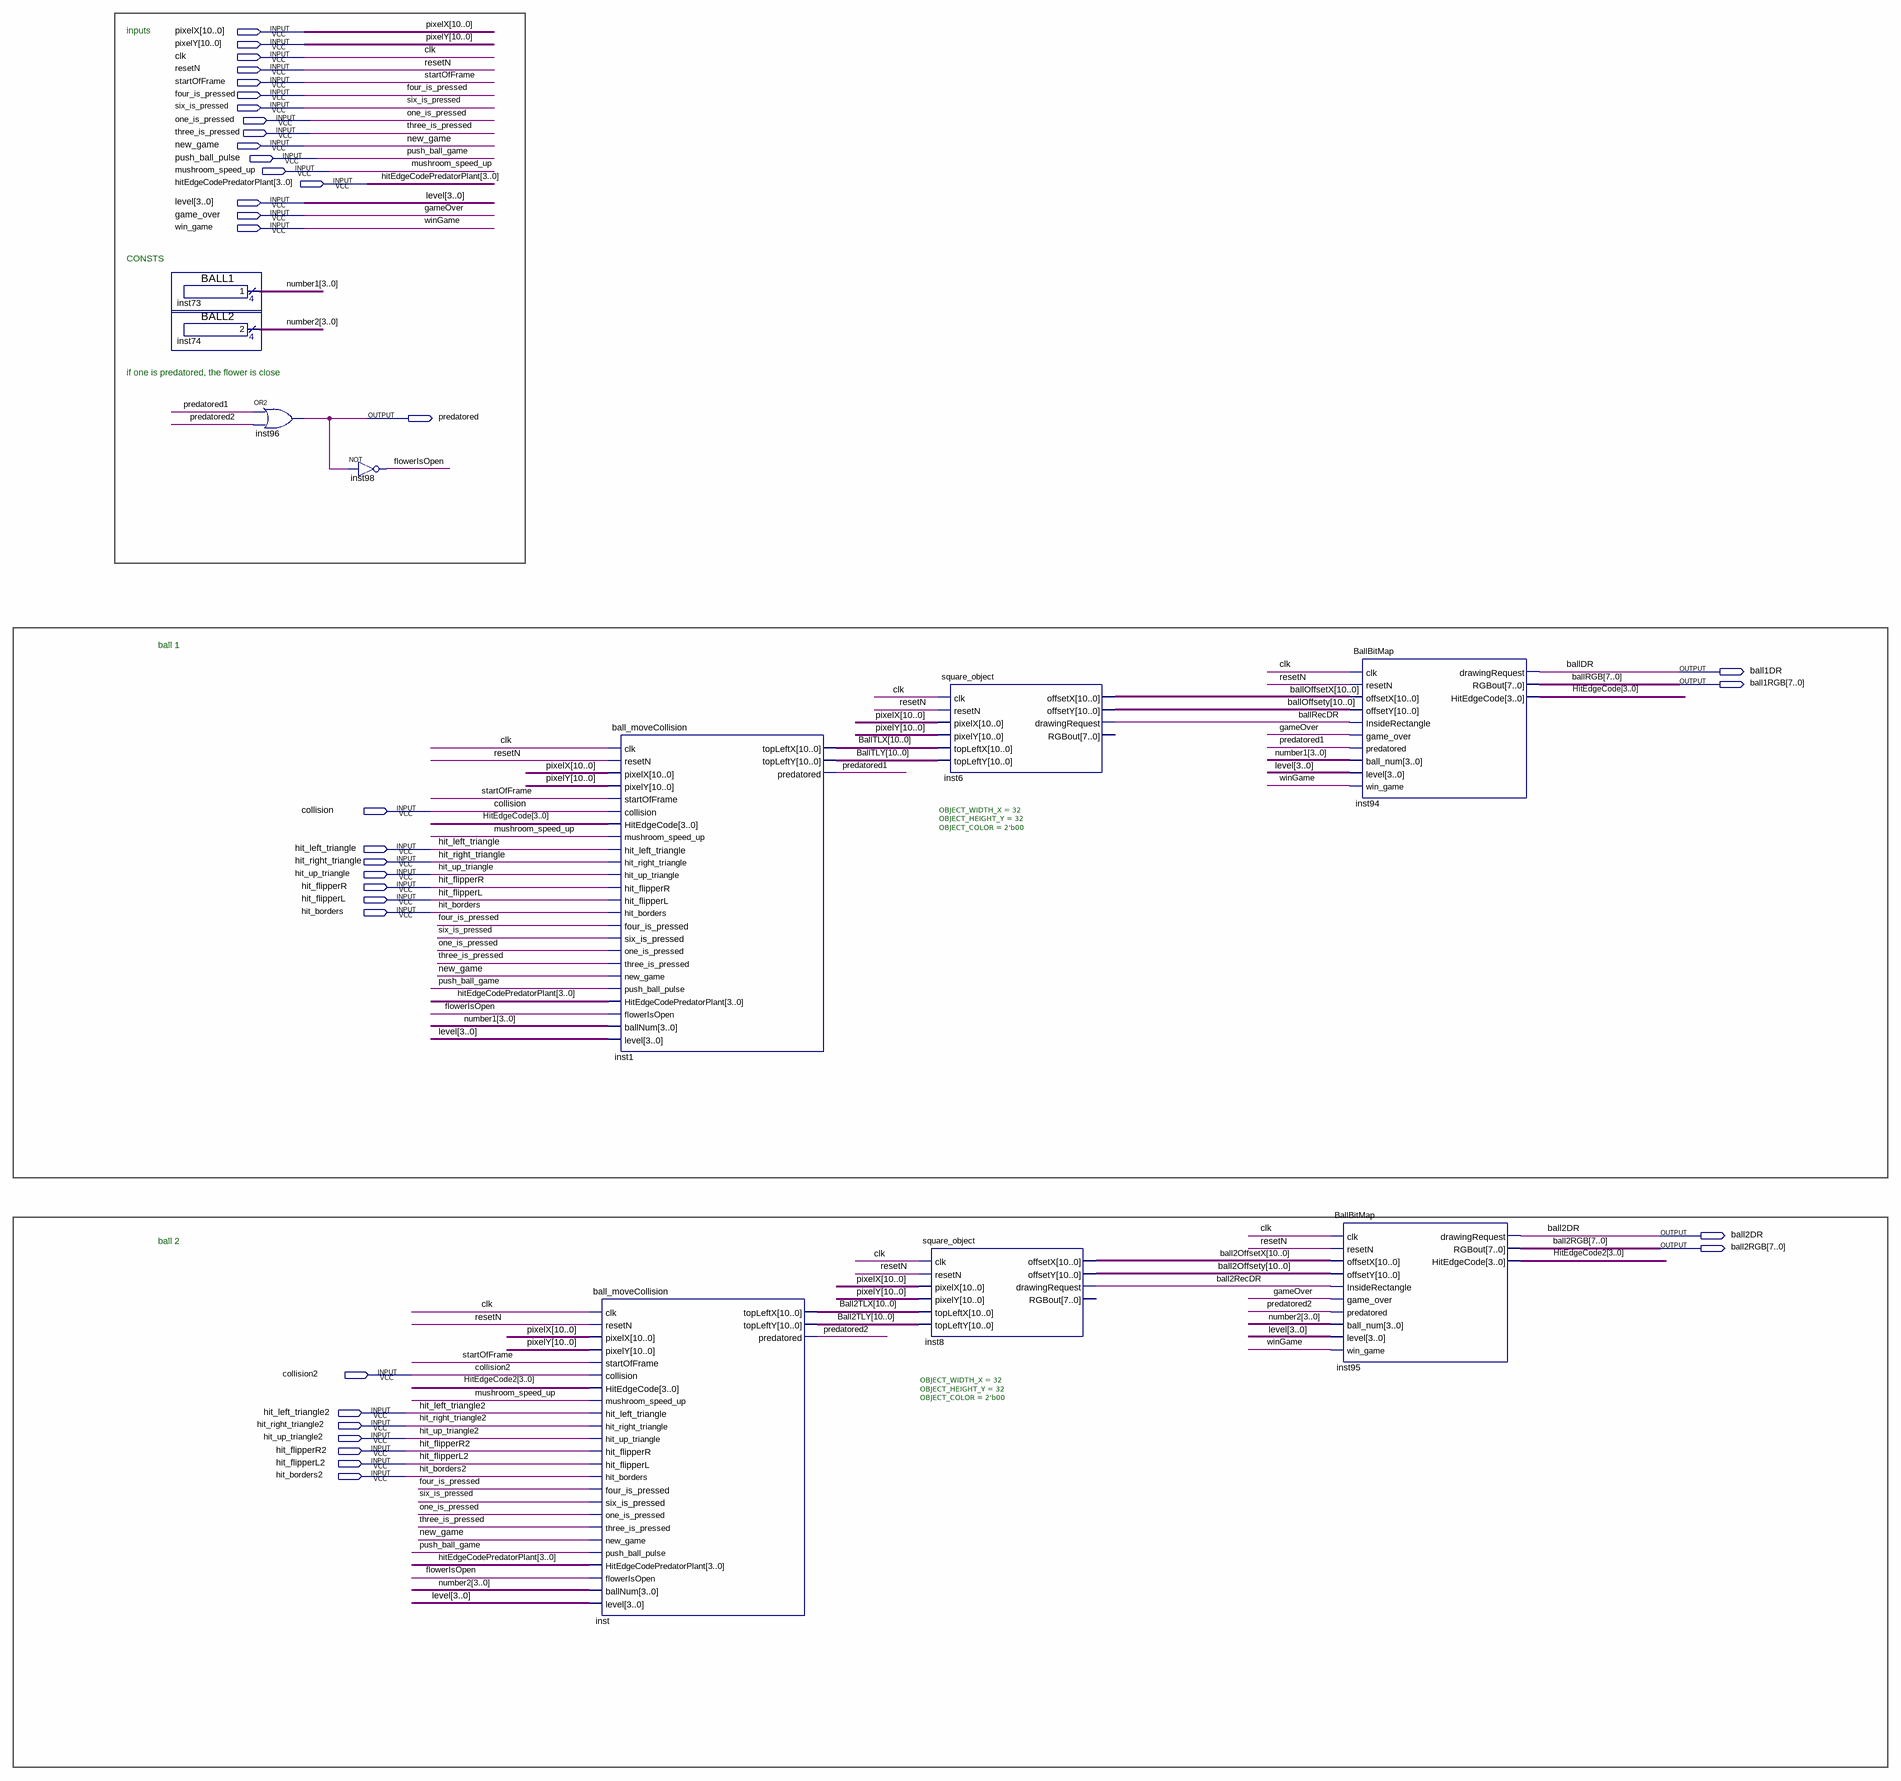
[diagram p0: schematic sheet]
// Quartus schematic BALL_BLOCK.bdf as structural Verilog: 10 symbols, 35 pins
module BALL_BLOCK (
  input  [10:0] pixelX,
  input  [10:0] pixelY,
  input  clk,
  input  resetN,
  input  startOfFrame,
  input  four_is_pressed,
  input  six_is_pressed,
  input  one_is_pressed,
  input  three_is_pressed,
  input  new_game,
  input  push_ball_pulse,
  input  mushroom_speed_up,
  input  [3:0] hitEdgeCodePredatorPlant,
  input  [3:0] level,
  input  game_over,
  input  win_game,
  input  collision,
  input  hit_left_triangle,
  input  hit_right_triangle,
  input  hit_up_triangle,
  input  hit_flipperR,
  input  hit_flipperL,
  input  hit_borders,
  input  collision2,
  input  hit_left_triangle2,
  input  hit_right_triangle2,
  input  hit_up_triangle2,
  input  hit_flipperR2,
  input  hit_flipperL2,
  input  hit_borders2,
  output predatored,
  output ball1DR,
  output [7:0] ball1RGB,
  output ball2DR,
  output [7:0] ball2RGB
);

  wire ball2RecDR, ballRecDR, flowerIsOpen, predatored1, predatored2;
  wire [3:0] HitEdgeCode, HitEdgeCode2, number1, number2;
  wire [10:0] ball2OffsetX, ball2Offsety, Ball2TLX, Ball2TLY, ballOffsetX, ballOffsety, BallTLX, BallTLY;

  BALL1 inst73 (.result(number1));
  BALL2 inst74 (.result(number2));
  or inst96 (predatored, predatored1, predatored2);
  not inst98 (flowerIsOpen, predatored);
  ball_moveCollision inst1 (
    .clk(clk), .resetN(resetN), .pixelX(pixelX), .pixelY(pixelY), .startOfFrame(startOfFrame),
    .collision(collision), .HitEdgeCode(HitEdgeCode), .mushroom_speed_up(mushroom_speed_up),
    .hit_left_triangle(hit_left_triangle), .hit_right_triangle(hit_right_triangle),
    .hit_up_triangle(hit_up_triangle), .hit_flipperR(hit_flipperR), .hit_flipperL(hit_flipperL),
    .hit_borders(hit_borders), .four_is_pressed(four_is_pressed), .six_is_pressed(six_is_pressed),
    .one_is_pressed(one_is_pressed), .three_is_pressed(three_is_pressed), .new_game(new_game),
    .push_ball_pulse(push_ball_pulse), .HitEdgeCodePredatorPlant(hitEdgeCodePredatorPlant),
    .flowerIsOpen(flowerIsOpen), .ballNum(number1), .level(level), .topLeftX(BallTLX), .topLeftY(BallTLY),
    .predatored(predatored1));
  ball_moveCollision inst (
    .clk(clk), .resetN(resetN), .pixelX(pixelX), .pixelY(pixelY), .startOfFrame(startOfFrame),
    .collision(collision2), .HitEdgeCode(HitEdgeCode2), .mushroom_speed_up(mushroom_speed_up),
    .hit_left_triangle(hit_left_triangle2), .hit_right_triangle(hit_right_triangle2),
    .hit_up_triangle(hit_up_triangle2), .hit_flipperR(hit_flipperR2), .hit_flipperL(hit_flipperL2),
    .hit_borders(hit_borders2), .four_is_pressed(four_is_pressed), .six_is_pressed(six_is_pressed),
    .one_is_pressed(one_is_pressed), .three_is_pressed(three_is_pressed), .new_game(new_game),
    .push_ball_pulse(push_ball_pulse), .HitEdgeCodePredatorPlant(hitEdgeCodePredatorPlant),
    .flowerIsOpen(flowerIsOpen), .ballNum(number2), .level(level), .topLeftX(Ball2TLX), .topLeftY(Ball2TLY),
    .predatored(predatored2));
  square_object #(.OBJECT_WIDTH_X(32), .OBJECT_HEIGHT_Y(32), .OBJECT_COLOR(2'b00)) inst8 (
    .clk(clk), .resetN(resetN), .pixelX(pixelX), .pixelY(pixelY), .topLeftX(Ball2TLX), .topLeftY(Ball2TLY),
    .offsetX(ball2OffsetX), .offsetY(ball2Offsety), .drawingRequest(ball2RecDR));  // open: RGBout
  square_object #(.OBJECT_WIDTH_X(32), .OBJECT_HEIGHT_Y(32), .OBJECT_COLOR(2'b00)) inst6 (
    .clk(clk), .resetN(resetN), .pixelX(pixelX), .pixelY(pixelY), .topLeftX(BallTLX), .topLeftY(BallTLY),
    .offsetX(ballOffsetX), .offsetY(ballOffsety), .drawingRequest(ballRecDR));  // open: RGBout
  BallBitMap inst95 (
    .clk(clk), .resetN(resetN), .offsetX(ball2OffsetX), .offsetY(ball2Offsety), .InsideRectangle(ball2RecDR),
    .game_over(game_over), .predatored(predatored2), .ball_num(number2), .level(level), .win_game(win_game),
    .drawingRequest(ball2DR), .RGBout(ball2RGB), .HitEdgeCode(HitEdgeCode2));
  BallBitMap inst94 (
    .clk(clk), .resetN(resetN), .offsetX(ballOffsetX), .offsetY(ballOffsety), .InsideRectangle(ballRecDR),
    .game_over(game_over), .predatored(predatored1), .ball_num(number1), .level(level), .win_game(win_game),
    .drawingRequest(ball1DR), .RGBout(ball1RGB), .HitEdgeCode(HitEdgeCode));

  // Other names for the same wires on the sheet: ballDR = ball1DR; ballRGB[7:0] = ball1RGB; gameOver = game_over;
  //   push_ball_game = push_ball_pulse; winGame = win_game

  // Notes on the sheet:
  //   inputs
  //   CONSTS
  //   if one is predatored, the flower is close 
  //   ball 1
  //   ball 2
endmodule
